# Altium schematic sheet DEV.Tnn.BRD.621.SchDoc: =DocumentName
size A4; CompanyName: "AS Manufacturing" LLC; Organization: "AS Manufacturing" LLC; Address1: 5 Sklyarenka St.; Address2: Kyiv 04073; Address3: Ukraine; Address4: https://ajax.systems/en/; SheetNumber: 1; SheetTotal: 1; Template_version: 1.0.1
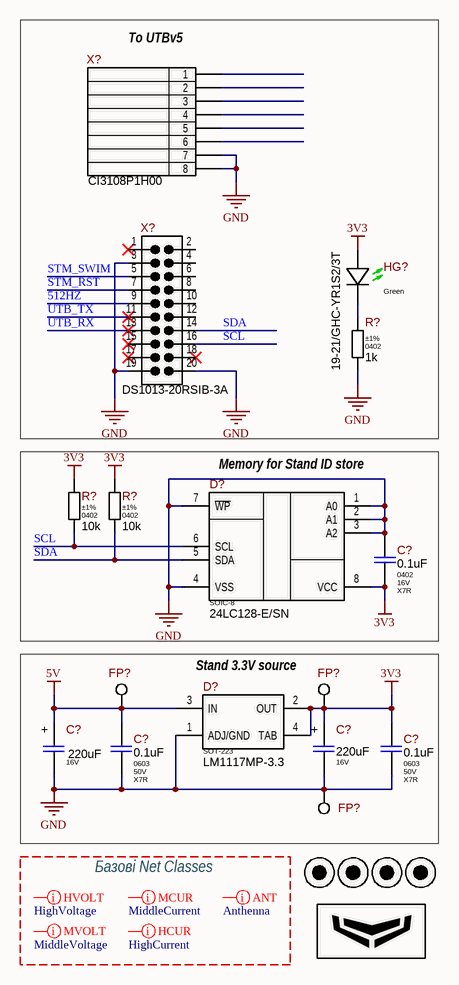
[diagram p0: DEV.Tnn.BRD.621.SchDoc]

## Parts
(Parts that share a designator on the sheet are numbered #1, #2 ... from top to bottom, then left to right.)
C?#1  Package: 0402  Voltage: 16V  Dielectric Type: X7R  [C_CERAMIC_0402_MED]  (hidden comment: 0.1uF)
C?#2  value 220uF  Voltage: 16V  [CAP-AE-840x650H30_MED]  (hidden comment: 220uFx16V)
C?#3  Package: 0603  Voltage: 50V  Dielectric Type: X7R  [C_CERAMIC_0603_MED]  (hidden comment: 0.1uF)
C?#4  value 220uF  Voltage: 16V  [CAP-AE-840x650H30_MED]  (hidden comment: 220uFx16V)
C?#5  Package: 0603  Voltage: 50V  Dielectric Type: X7R  [C_CERAMIC_0603_MED]  (hidden comment: 0.1uF)
D?#1  Package: SOIC-8  [SOIC-8_W3.9MM]  (hidden comment: 24LC128-E/SN)
D?#2  LM1117MP-3.3  [SOT-223]
FID?#1  Fiducial  [Fiducial_10-20]  (value not drawn)  (no BOM)
FID?#2  Fiducial  [Fiducial_10-20]  (value not drawn)  (no BOM)
FID?#3  Fiducial  [Fiducial_10-20]  (value not drawn)  (no BOM)
FID?#4  Fiducial  [Fiducial_10-20]  (value not drawn)  (no BOM)
FP?#1  PAD-1.1mm  [PAD-1.1mm]  (value not drawn)  (no BOM)
FP?#2  PAD-1.1mm  [PAD-1.1mm]  (value not drawn)  (no BOM)
FP?#3  PAD-1.1mm  [PAD-1.1mm]  (value not drawn)  (no BOM)
HG?  Color: Green  [LED-0603G-0.8mm]  (hidden comment: 19-21/GHC-YR1S2/3T)
LOGO?  Ajax Logo  [Logo_Solder_v2]  (value not drawn)  (no BOM)
R?#1  Tolerance: ±1%  Package: 0402  [R_ANY_CHIP_0402_MED]  (hidden comment: 1k)
R?#2  Tolerance: ±1%  Package: 0402  [R_ANY_CHIP_0402_MED]  (hidden comment: 10k)
R?#3  Tolerance: ±1%  Package: 0402  [R_ANY_CHIP_0402_MED]  (hidden comment: 10k)
X?#1  Part Number: CI3108P1H00  [WF-8R]  (hidden comment: WH-08R)
X?#2  DS1013-20RSIB-3A  [BH-20R]

## Blocks framed on the sheet
To UTBv5: HG? R?#1 X?#1 X?#2
Memory for Stand ID store: C?#1 D?#1 R?#2 R?#3
Stand 3.3V source: C?#2-C?#5 D?#2 FP?#1-FP?#3

## Nets
3V3: C?#1.1 C?#4.1 C?#5.1 D?#1.8(VCC) D?#2.2(OUT) D?#2.4(TAB) FP?#2.1 HG?.AN(Anode) R?#2.2 R?#3.2
5V: C?#2.1 C?#3.1 D?#2.3(IN) FP?#1.1
GND: C?#1.2 C?#2.2 C?#3.2 C?#4.2 C?#5.2 D?#1.1(A0) D?#1.2(A1) D?#1.3(A2) D?#1.4(VSS) D?#1.7(~{WP}) D?#2.1(ADJ/GND) FP?#3.1 R?#1.2 X?#1.7 X?#1.8 X?#2.3 X?#2.19 X?#2.20
512HZ: X?#2.9
SCL: D?#1.6(SCL) R?#2.1 X?#2.16
SDA: D?#1.5(SDA) R?#3.1 X?#2.14
STM_RST: X?#2.7
STM_SWIM: X?#2.5
UTB_RX: X?#2.13
UTB_TX: X?#2.11
NetHG?_CA: HG?.CA(Cathode) R?#1.1

Not connected (* = marked no-connect by the designer): X?#1 1 2 3 4 5 6; X?#2 1* 2 4 6 8 10 12 15* 17* 18*

## Layout directives
net class HighVoltage: (no net found under the mark)
net class Anthenna: (no net found under the mark)
net class MiddleVoltage: (no net found under the mark)
net class MiddleCurrent: (no net found under the mark)
net class HighCurrent: (no net found under the mark)

## Notes on the sheet
- Базові Net Classes
- Title
- Product:
- Project:
- Size:
- Date:
- Variant:
- A4
- Authors:
- Time:
- Sheet
- of
- Revision:
- Commit:
- (in symbol ELV221M16RD) +

## Library data of the parts
C?#1 = CC0402KRX7R7BB104: 100nF 16V X7R ±10% 0402 Ceramic Capacitor RoHS; Manufacturer: Yageo; Ajax_1C_ID: 13183; Ajax_1C_PN: 100nF 16V X7R 10% 0402 CC0402KRX7R7BB104 Ceramic Capacitor SMD RoHS; Standard Lead Time: 33 Weeks; Replacement: NONE; Ajax_1С_Status: Mass Production; Component Status: Released; GUID_1C: 31172856-89aa-11e8-ab42-0050569f2651; Value: 0.1uF; Part Number: CC0402KRX7R7BB104; Part Type: Ceramic / X7R / 0402; Component Type: SMD; Temperature Range: -55°C ~ 125°C; Tolerance: ±10%; ComponentLink1URL: https://www.yageo.com/upload/media/product/productsearch/datasheet/mlcc/UPY-GPHC_X7R_6.3V-to-50V_18.pdf; Supplier 1: Digi-Key; Supplier Part Number 1: 311-1338-2-ND; ComponentLink1Description: Datasheet; Price: 0,0017
C?#2 C?#4 = ELV221M16RD: 220uF 16V ELV Size E D8x6.5mm Electrolytic Capacitor; Manufacturer: Hitano; Ajax_1C_ID: 7259; Ajax_1C_PN: 220uF 16V ELV SMD sizeD 8x6.5 (ELV221M16RD); Standard Lead Time: NONE; Component Status: Released; Tolerance: ±20%; GUID_1C: da1ae17b-8956-11e5-80e1-d8cb8a9acc66; Ajax_1С_Status: Mass Production; Package: Size E D8x6.5mm; Part Number: ELV221M16RD; Part Type: Aluminum; Component Type: SMD; Lifecycle: Not Recommended; Temperature Range: -40°C ~ 85°C; Dielectric Type: NONE; ComponentLink1URL: https://www.hitano.com.tw/wp-content/uploads/doc/ELV_20200810.pdf; Replacement: NONE; ComponentLink1Description: Datasheet; Price: 0,065
C?#3 C?#5 = CL10B104KB8NNNC: 100nF 50V X7R ±10% 0603 Ceramic Capacitor RoHS; Manufacturer: Samsung Electro-Mechanics; Ajax_1C_ID: 15653; Ajax_1C_PN: 100nF 50V X7R 10% 0603 CL10B104KB8NNNC ceramic capacitor SMD; Standard Lead Time: 18 Weeks; Replacement: NONE; Ajax_1С_Status: Mass Production; Component Status: Released; GUID_1C: 28d36f8f-5d05-11e9-ab4e-0050569f2651; Value: 0.1uF; Part Number: CL10B104KB8NNNC; Part Type: Ceramic / X7R / 0603; Component Type: SMD; Temperature Range: -55°C ~ 125°C; Tolerance: ±10%; ComponentLink1URL: https://media.digikey.com/pdf/Data%20Sheets/Samsung%20PDFs/CL_Series_MLCC_ds.pdf; Supplier 1: Digi-Key; Supplier Part Number 1: 1276-1000-2-ND; ComponentLink1Description: Datasheet; Price: 0,00245
D?#1 = 24LC128-E/SN: EEPROM Memory IC 128Kb (16K x 8) I2C 400kHz 900ns SOIC-8; Manufacturer: Microchip Technology; Ajax_1C_PN: 24LC128-E/SN SO8; Standard Lead Time: 6 Weeks; Component Status: On Review; Replacement: NONE; Ajax_1C_ID: 10590; Ajax_1С_Status: RND Only; GUID_1C: 19c1e12f-7c36-11e7-813c-14dda9d2d04d; Part Number: 24LC128-E/SN; Part Type: Memory / EEPROM; Component Type: SMD; Temperature Range: -40°C ~ 125°C; ComponentLink1URL: http://www.microchip.com/mymicrochip/filehandler.aspx?ddocname=en011851; Supplier 1: Mouser; Supplier Part Number 1: 579-24LC128-E/SN; ComponentLink1Description: Datasheet; Price: 0,94
D?#2 = LM1117MP-3.3: Linear Voltage Regulator IC 1 Output 800mA, Up to 15V Vin, SOT-223; Manufacturer: Texas Instruments; Ajax_1C_PN: LM1117MP-3.3 Molded SOT-223, 6.50 x 3.56 x 1.6mm Body, 4 Lead, 2.3mm Pitch MP04A_N	1SPX; Standard Lead Time: 6 Weeks; Component Status: Released; Replacement: NONE; Ajax_1C_ID: 9463; Ajax_1С_Status: RND Only; GUID_1C: e0b887c0-e6df-11e6-82a6-d8cb8a9acc66; Package: SOT-223; Part Number: LM1117MP-3.3; Part Type: Power / Linear Regulator; Component Type: SMD; Temperature Range: 0°C ~ 125°C; ComponentLink1URL: https://www.ti.com/lit/ds/symlink/lm1117.pdf; Supplier 1: Digi-Key; Supplier Part Number 1: LM1117MP-3.3/NOPBTR-ND; ComponentLink1Description: Datasheet; Price: 1,08687616
FID?#1-FID?#4 = Fiducial: IPC Compliant Fiducial Mark, 1mm; Manufacturer: Ajax Systems; Ajax_1C_PN: NONE; Component Status: Released; Part Number: Fiducial; Component Type: SMD; Part Type: PCB Element; Temperature Range: NONE; ComponentLink1URL: NONE; Replacement: NONE; ComponentLink1Description: Datasheet; Ajax_1С_Status: NONE; Price: NONE
FP?#1-FP?#3 = PAD-1.1mm: 1.1mm Pad for Plug-In or Receptacle; Ajax_1C_PN: NONE; Ajax_1С_Status: RND Only; Component Status: Released; Part Number: PAD-1.1mm; Component Type: PTH; Lifecycle: ="Lifecycle"; Manufacturer: NONE; Part Type: Pad; Temperature Range: NONE; ComponentLink1URL: NONE; Replacement: NONE; ComponentLink1Description: Datasheet; Price: NONE
HG? = 19-21/GHC-YR1S2/3T: Indication LED, Green 528nm, Clear, SMD 0603, Vf 2.7-3.7V, 112 - 285mcd @ 20mA, 110°; Manufacturer: Everlight Electronics Co.,Ltd; Ajax_1C_PN: NONE; Component Status: Released; Ajax_1С_Status: RND Only; Part Number: 19-21/GHC-YR1S2/3T; Part Type: LED; Component Type: SMD; Lifecycle: Not Recommended; Package: 0603; Wavelength: 528nm; Temperature Range: -40°C ~ 85°C; ComponentLink1URL: https://media.digikey.com/pdf/Data%20Sheets/Everlight%20PDFs/19-21-GHC-YR1S2-3T.pdf; Supplier 1: Digi-Key; Supplier Part Number 1: 19-21/GHC-YR1S2/3T-ND; Replacement: NONE; ComponentLink1Description: Datasheet; Price: NONE
LOGO? = Ajax Logo (Solder): Ajax Solder Logo for PCBs; Manufacturer: Ajax Systems; Ajax_1C_PN: NONE; Component Status: Released; Part Number: Ajax Logo (Solder); Component Type: SMD; Part Type: PCB Element; Temperature Range: NONE; ComponentLink1URL: NONE; Replacement: NONE; ComponentLink1Description: Datasheet; Ajax_1С_Status: NONE; Price: NONE
R?#1 = RC0402FR-071KL: 1 kOhms ±1% 1/16W 0402 Thick Film Resistor; Manufacturer: Yageo; Ajax_1C_ID: 4845; Ajax_1C_PN: 1k 1% 0402 Resistors SMD RoHS; Power Rating: 0.062W; Voltage: 50V; Temperature Stability: ±100ppm/°C; Replacement: NONE; Ajax_1С_Status: Mass Production; Component Status: Released; GUID_1C: bf05aaa5-08f0-11e4-b679-a45d36c4a9e5; Value: 1k; Part Number: RC0402FR-071KL; Component Type: SMD; Temperature Range: -55°C ~ 155°C; ComponentLink1URL: https://www.yageo.com/upload/media/product/productsearch/datasheet/rchip/PYu-RC_Group_51_RoHS_L_10.pdf; Supplier 1: Digi-Key; Supplier Part Number 1: 311-1.00KLRTR-ND; ComponentLink1Description: Datasheet; Price: 0,00065
R?#2 R?#3 = RC0402FR-0710KL: 10 kOhms ±1% 1/16W 0402 Thick Film Resistor; Manufacturer: Yageo; Ajax_1C_ID: 6717; Ajax_1C_PN: 10k 1% 0402 Resistors SMD RoHS; Power Rating: 0.062W; Voltage: 50V; Temperature Stability: ±100ppm/°C; Replacement: NONE; Ajax_1С_Status: Mass Production; Component Status: Released; GUID_1C: 2e173059-2610-11e5-ad28-a45d36c4a9e5; Value: 10k; Part Number: RC0402FR-0710KL; Component Type: SMD; Temperature Range: -55°C ~ 155°C; ComponentLink1URL: https://www.yageo.com/upload/media/product/productsearch/datasheet/rchip/PYu-RC_Group_51_RoHS_L_10.pdf; ComponentLink1Description: Datasheet; Supplier 1: Digi-Key; Supplier Part Number 1: 311-10.0KLRTR-ND; Price: 0,00065
X?#1 = CI3108P1H00: WH Series 2.54mm Wire to Board Right Angle DIP Type Headers, 8 Pin; Manufacturer: CviLux; Ajax_1C_PN: WF-08R (CWH-WMС-8pin); Штекер "папа"; 8 контактов; шаг 2.54мм; угловой; на плату; Replacement: NONE; Ajax_1C_ID: 12831; Ajax_1С_Status: RND Only; Component Status: Released; GUID_1C: c8ae2369-64b4-11e8-ab3c-0050569f2651; System: Connector; Part Type: Wire-to-Board / Header; Component Type: PTH; Temperature Range: -25℃ ~ 85℃; ComponentLink1URL: \\altiumdb.ajax.local\files\Datasheet\Connectors\CI3103S.pdf; ComponentLink1Description: Datasheet; Price: 0,0175
X?#2 = DS1013-20RSIB-3A: 2.54mm Right Angle Box Header, Two Row, 20 Pin, 20mOhm max; Manufacturer: Connfly; Ajax_1C_ID: 8560; Ajax_1C_PN: BH-20R : Вилка в плату IDC угловая : IDC-20MR; Replacement: NONE; Ajax_1С_Status: Mass Production; Component Status: Released; GUID_1C: 731205be-314d-11e6-81b9-d8cb8a9acc66; System: Connector; Part Number: DS1013-20RSIB-3A; Part Type: IDC / Right Angle; Component Type: PTH; Temperature Range: -40°C ~ 105°C; ComponentLink1URL: \\altiumdb.ajax.local\files\Datasheet\Connectors\DS1013.pdf; ComponentLink1Description: Datasheet; Price: 0,1718